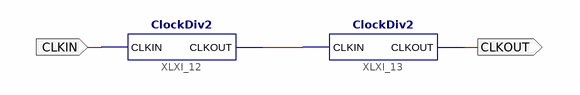
[diagram p0: schematic sheet 1]
// Xilinx ISE schematic ClockDiv.sch (xbr) as structural Verilog: 2 symbols, 2 ports
module ClockDiv (
  input  CLKIN,
  output CLKOUT
);

  wire XLXN_15;

  ClockDiv2 XLXI_12 (.CLKIN(CLKIN), .CLKOUT(XLXN_15));
  ClockDiv2 XLXI_13 (.CLKIN(XLXN_15), .CLKOUT(CLKOUT));
endmodule
